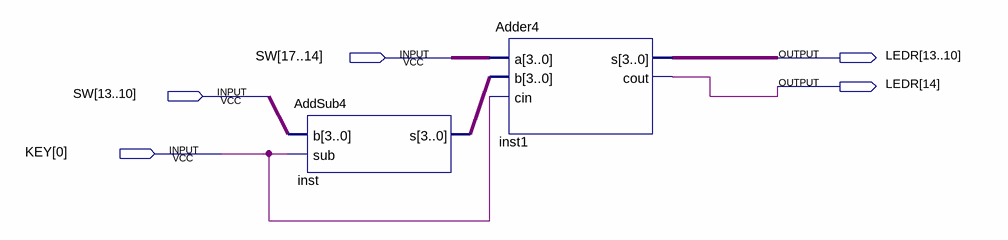
[diagram p0: schematic sheet]
// Quartus schematic AdderDemo.bdf as structural Verilog: 2 symbols, 5 pins
module AdderDemo (
  input  [17:10] SW,
  input  [0:0] KEY,
  output [14:10] LEDR
);

  wire [3:0] inst_s;

  AddSub4 inst (.b(SW[13:10]), .sub(KEY[0]), .s(inst_s));
  Adder4 inst1 (.a(SW[17:14]), .b(inst_s), .cin(KEY[0]), .s(LEDR[13:10]), .cout(LEDR[14]));
endmodule
